# EasyEDA schematic ECFFL2023-v3-schem.json
TITLE: ElektroClub 2023 FLL De Kempel; REV: 1.0a; Date: 2023-10-01; Sheet: 1/1; Drawn By: Maarten Pennings; Company: Maarten Pennings
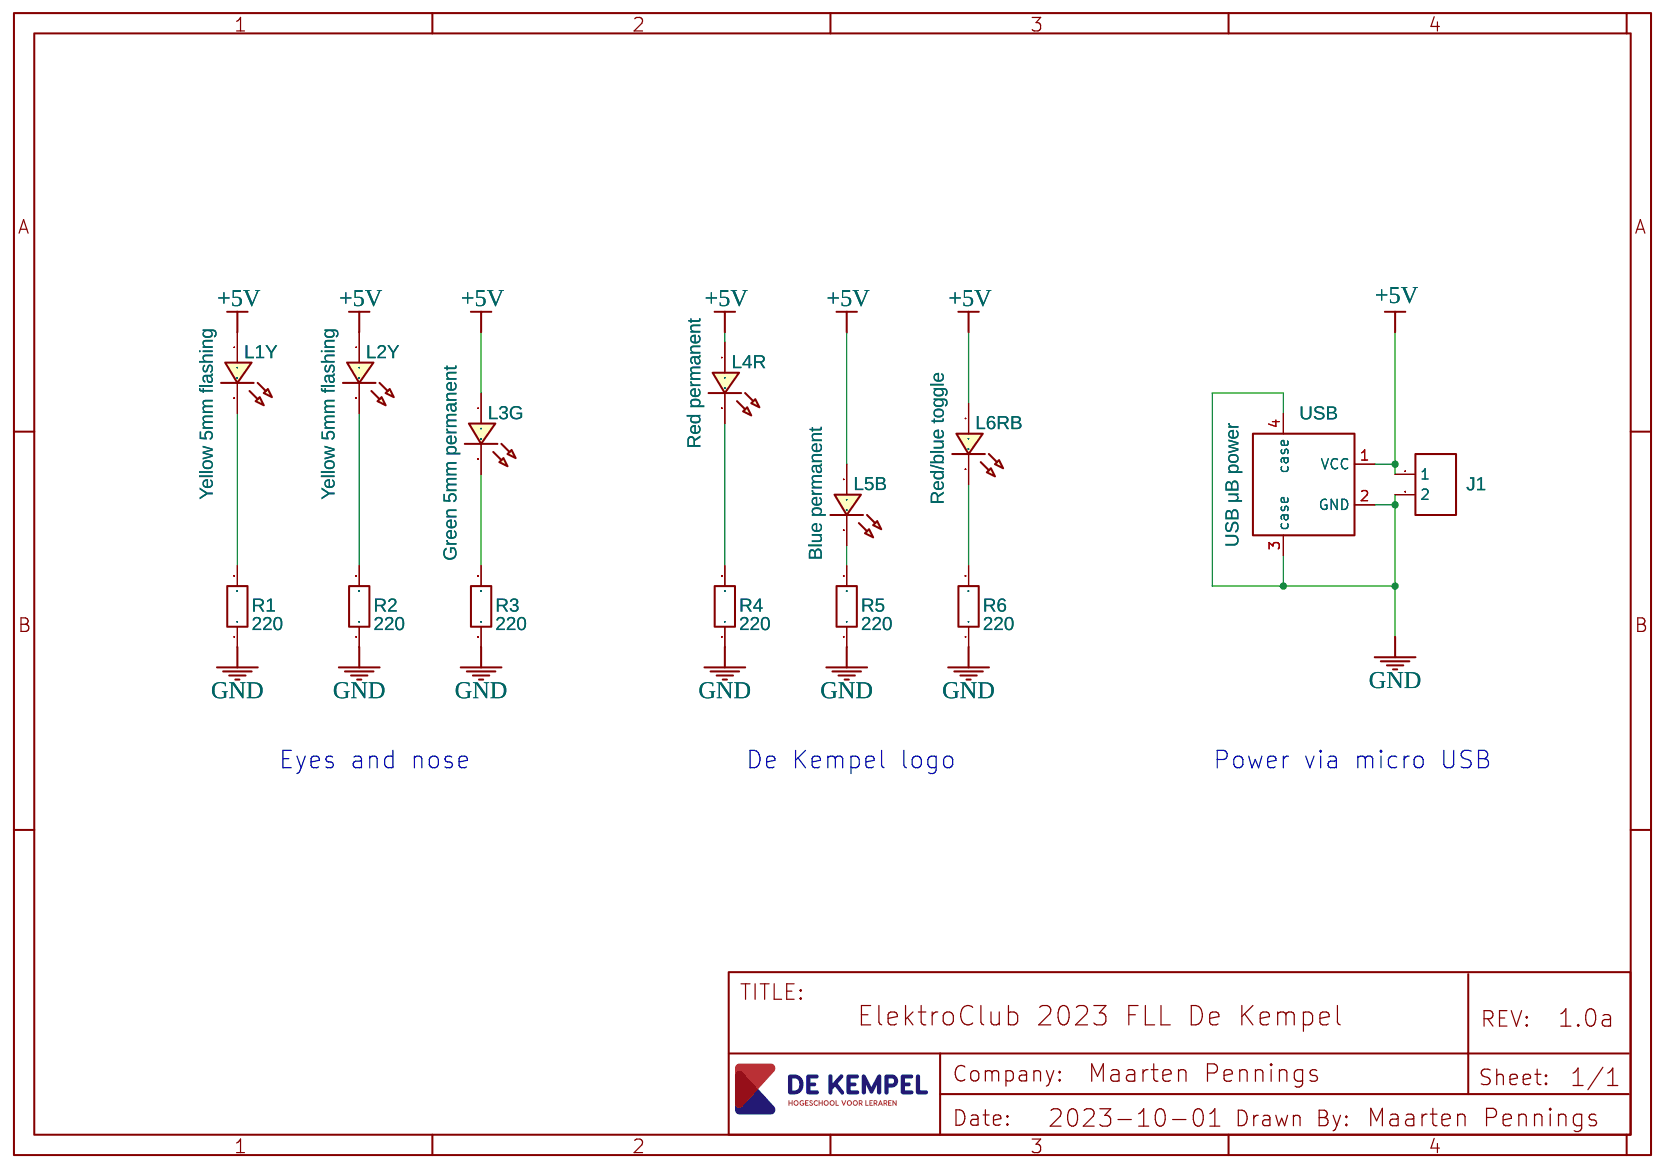
[diagram p0: schematic sheet]

## Parts
J1  HDR-M-2.54_1x2  [HDR-M-2.54_1X2]
L1Y  Yellow 5mm flashing  [LED-TH_BD5.0_GREEN]
L2Y  Yellow 5mm flashing  [LED-TH_BD5.0_GREEN]
L3G  Green 5mm permanent  [LED-TH_BD5.0_GREEN]
L4R  Red permanent  [LED-TH_BD5.0_RED]
L5B  Blue permanent  [LED-TH_BD5.0_BLUE]
L6RB  Red/blue toggle  [LED-TH_BD5.0_BLUE]
R1  220  [R_AXIAL-0.4]
R2  220  [R_AXIAL-0.4]
R3  220  [R_AXIAL-0.4]
R4  220  [R_AXIAL-0.4]
R5  220  [R_AXIAL-0.4]
R6  220  [R_AXIAL-0.4]
USB  USB μB power  [USB MICRO B TH]

## Library data of the parts
J1 = HDR-M-2.54_1x2: Supplier Part: C124375; Supplier: LCSC; Contributor: LCEDA_Lib
L1Y L2Y L3G = LED-TH-5mm_G: Manufacturer: EVERLIGHT(台湾亿光); Manufacturer Part: 333-2SYGD/S530-E2; Supplier Part: C88163; Supplier: LCSC; Contributor: LCEDA_Lib
L4R = LED-TH-5mm_R: Manufacturer: EVERLIGHT(台湾亿光); Manufacturer Part: 333-2SURD/S530-A3; Supplier Part: C87271; Supplier: LCSC; Contributor: LCEDA_Lib
L5B L6RB = LED-TH-5mm_B: Supplier: LCSC; Contributor: LCEDA_Lib
R1-R6 = R_AXIAL-0.4_EU: Contributor: LCEDA_Lib
USB = USB μB power: Manufacturer: HBXINTAO; Manufacturer Part: JK1-268; Supplier: Ali Express; Supplier Part: 1005003803598713; link: https://www.aliexpress.com/item/1005003803598713.html; Contributor: Maarten Pennings

## Nets
+5V: J1.1 L1Y.1 L2Y.1 L3G.1 L4R.1 L5B.1 L6RB.1 USB.1(VCC)
GND: J1.2 R1.1 R2.1 R3.1 R4.1 R5.1 R6.1 USB.2(GND) USB.3(case) USB.4(case)
Net-(L1Y-2): L1Y.2 R1.2
Net-(L2Y-2): L2Y.2 R2.2
Net-(L3G-2): L3G.2 R3.2
Net-(L4R-2): L4R.2 R4.2
Net-(L5B-2): L5B.2 R5.2
Net-(L6RB-2): L6RB.2 R6.2

## Notes on the sheet
- Eyes and nose
- De Kempel logo
- Power via micro USB
